# Altium project Car2014_finalRev.PrjPcb
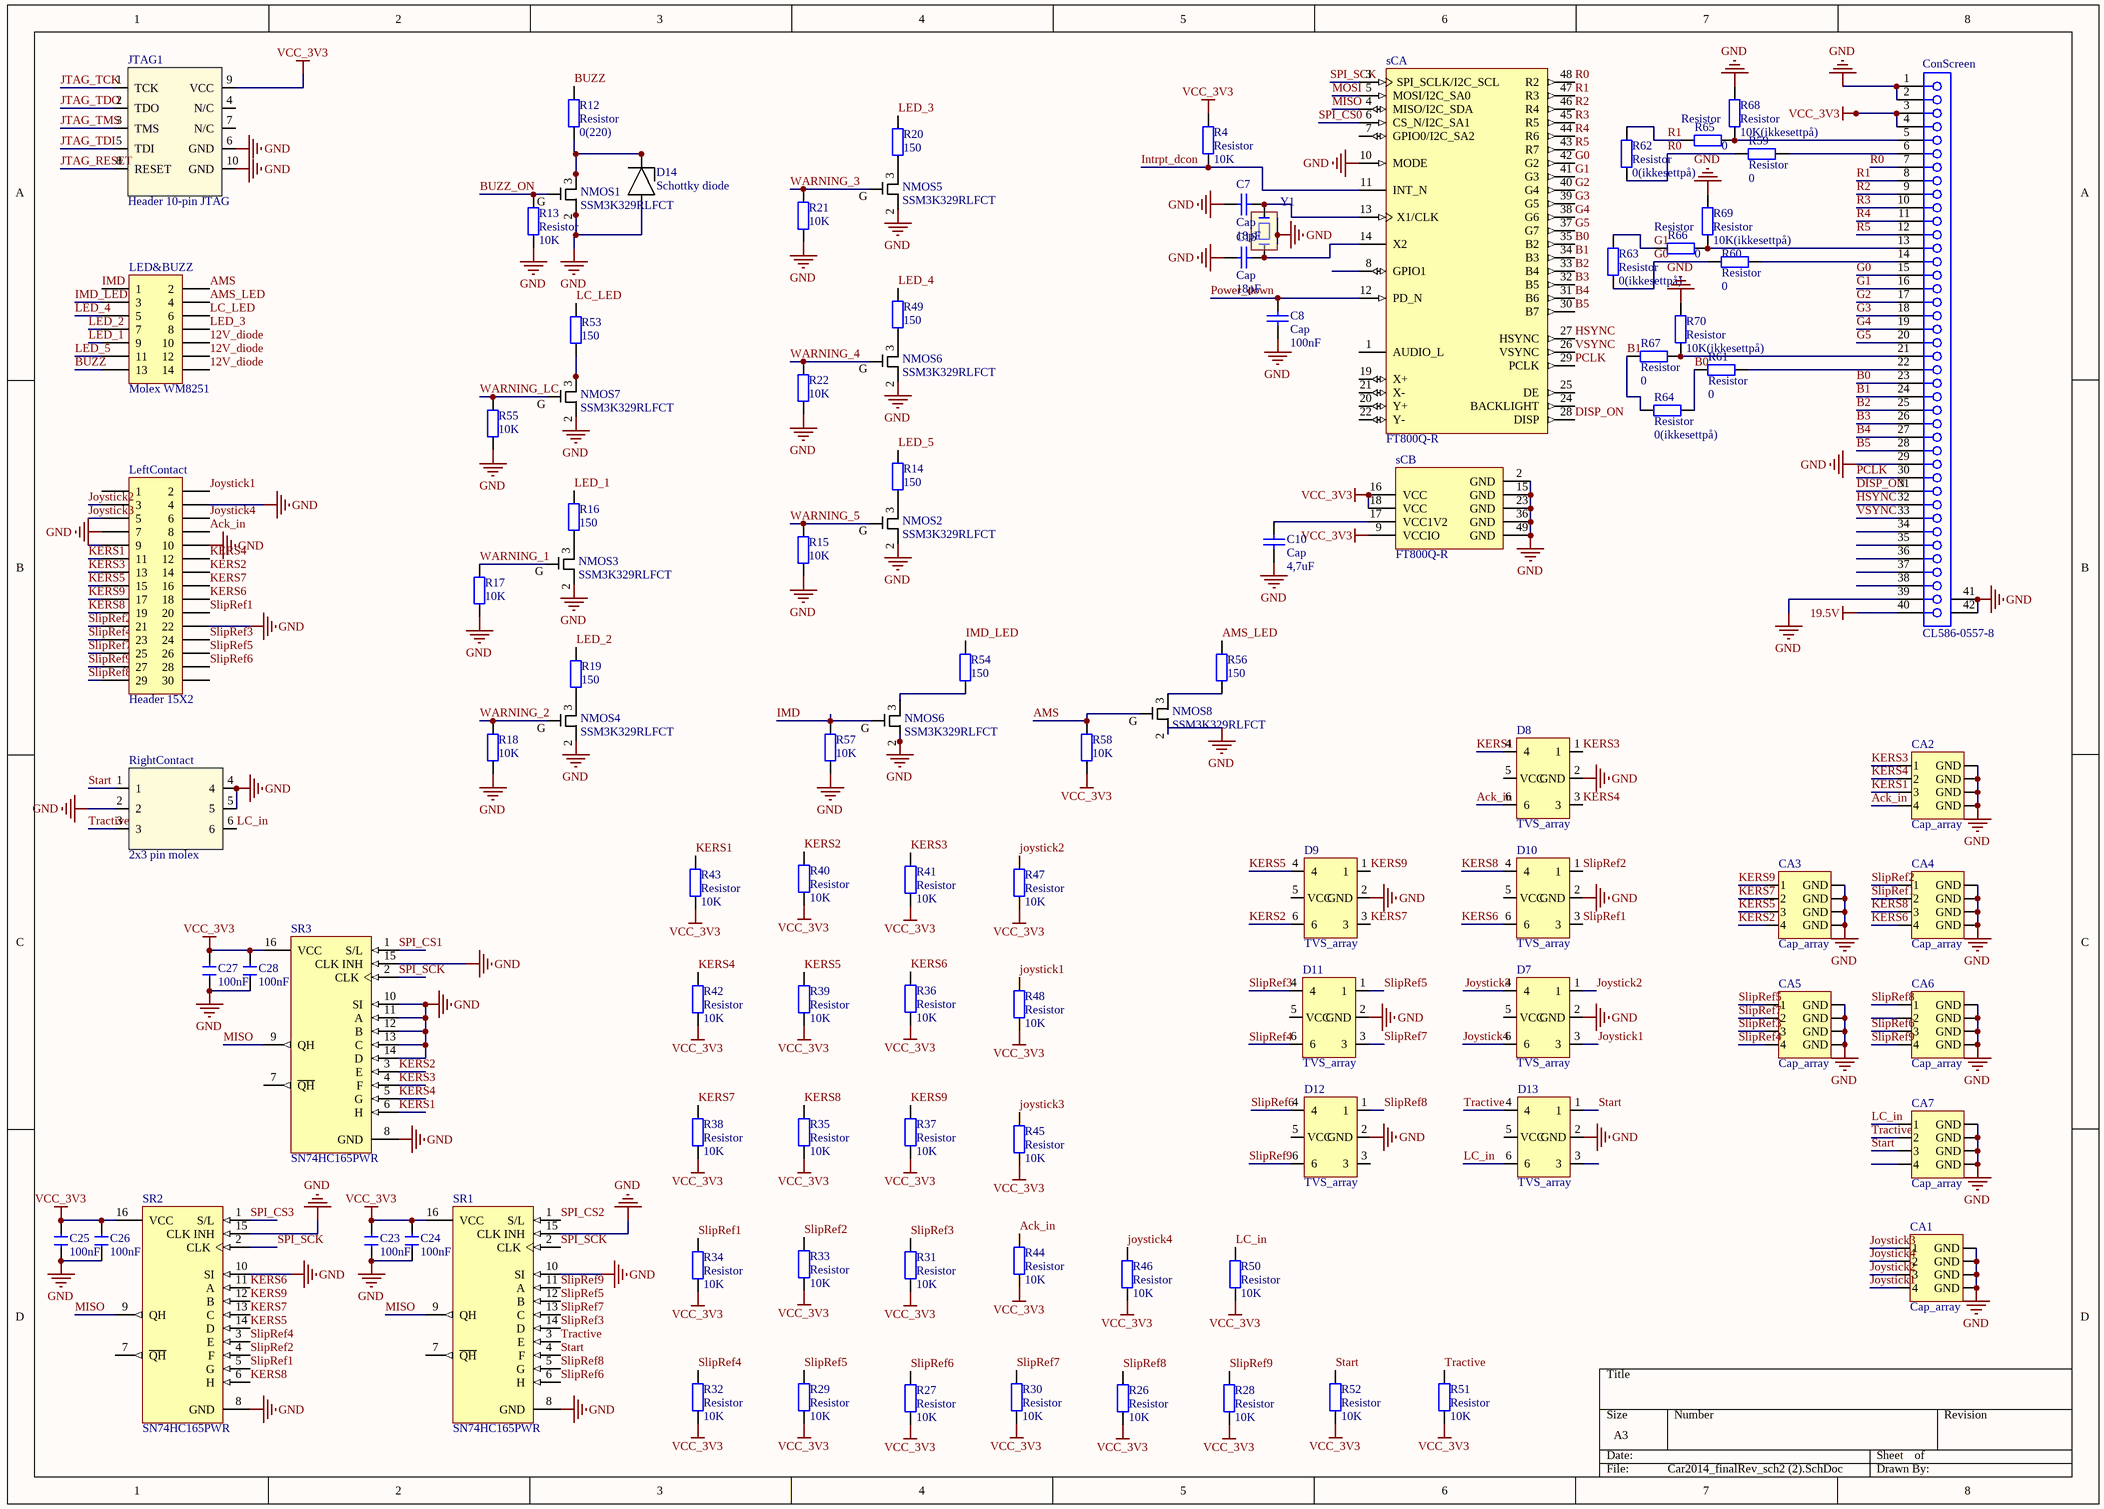
[diagram p0: Car2014_finalRev_sch2 (2).SchDoc]
2 sheets, 155 parts. Net scope: global (net labels, ports and power ports of the same name join across sheets).
Board file: Car2014_finalRev.PcbDoc
Sheets:
  Car2014_finalRev_sch2 (2).SchDoc
  Car2014_finalRev_sch1.SchDoc

## Sheet Car2014_finalRev_sch2 (2).SchDoc
size A3

### Parts
(Parts that share a designator on the sheet are numbered #1, #2 ... from top to bottom, then left to right.)
C7  Cap  value 18pF  [1608[0603]]
C8  Cap  value 100nF  [1608[0603]]
C10  Cap  value 4,7uF  [c0805]
C16  Cap  value 18pF  [1608[0603]]
C23  value 100nF  [CAPC1608L]  (hidden comment: Cap)
C24  value 100nF  [CAPC1608L]  (hidden comment: Cap)
C25  value 100nF  [CAPC1608L]  (hidden comment: Cap)
C26  value 100nF  [CAPC1608L]  (hidden comment: Cap)
C27  value 100nF  [CAPC1608L]  (hidden comment: Cap)
C28  value 100nF  [CAPC1608L]  (hidden comment: Cap)
CA1  Cap_array  [Cap_array_0805]
CA2  Cap_array  [Cap_array_0805]
CA3  Cap_array  [Cap_array_0805]
CA4  Cap_array  [Cap_array_0805]
CA5  Cap_array  [Cap_array_0805]
CA6  Cap_array  [Cap_array_0805]
CA7  Cap_array  [Cap_array_0805]
ConScreen  CL586-0557-8  [FH12A-40S-0.5SH]
D7  TVS_array  [TVS_array_SOT23]
D8  TVS_array  [TVS_array_SOT23]
D9  TVS_array  [TVS_array_SOT23]
D10  TVS_array  [TVS_array_SOT23]
D11  TVS_array  [TVS_array_SOT23]
D12  TVS_array  [TVS_array_SOT23]
D13  TVS_array  [TVS_array_SOT23]
D14  Schottky diode  [1608[0603]]
JTAG1  Header 10-pin JTAG  [10pin Header]
LED&BUZZ  Molex WM8251  [HDR2X7]
LeftContact  Header 15X2  [HDR2X15]
NMOS1  SSM3K329RLFCT  [SOT23]
NMOS2  SSM3K329RLFCT  [SOT23]
NMOS3  SSM3K329RLFCT  [SOT23]
NMOS4  SSM3K329RLFCT  [SOT23]
NMOS5  SSM3K329RLFCT  [SOT23]
NMOS6#1  SSM3K329RLFCT  [SOT23]
NMOS6#2  SSM3K329RLFCT  [SOT23]
NMOS7  SSM3K329RLFCT  [SOT23]
NMOS8  SSM3K329RLFCT  [SOT23]
R4  Resistor  value 10K  [1608[0603]]
R12  Resistor  value 0(220)  [1608[0603]]
R13  Resistor  value 10K  [1608[0603]]
R14  value 150  [RESC1608L]  (hidden comment: Resistor)
R15  value 10K  [RESC1608L]  (hidden comment: Resistor)
R16  value 150  [RESC1608L]  (hidden comment: Resistor)
R17  value 10K  [RESC1608L]  (hidden comment: Resistor)
R18  value 10K  [RESC1608L]  (hidden comment: Resistor)
R19  value 150  [RESC1608L]  (hidden comment: Resistor)
R20  value 150  [RESC1608L]  (hidden comment: Resistor)
R21  value 10K  [RESC1608L]  (hidden comment: Resistor)
R22  value 10K  [RESC1608L]  (hidden comment: Resistor)
R26  Resistor  value 10K  [1608[0603]]
R27  Resistor  value 10K  [1608[0603]]
R28  Resistor  value 10K  [1608[0603]]
R29  Resistor  value 10K  [1608[0603]]
R30  Resistor  value 10K  [1608[0603]]
R31  Resistor  value 10K  [1608[0603]]
R32  Resistor  value 10K  [1608[0603]]
R33  Resistor  value 10K  [1608[0603]]
R34  Resistor  value 10K  [1608[0603]]
R35  Resistor  value 10K  [1608[0603]]
R36  Resistor  value 10K  [1608[0603]]
R37  Resistor  value 10K  [1608[0603]]
R38  Resistor  value 10K  [1608[0603]]
R39  Resistor  value 10K  [1608[0603]]
R40  Resistor  value 10K  [1608[0603]]
R41  Resistor  value 10K  [1608[0603]]
R42  Resistor  value 10K  [1608[0603]]
R43  Resistor  value 10K  [1608[0603]]
R44  Resistor  value 10K  [1608[0603]]
R45  Resistor  value 10K  [1608[0603]]
R46  Resistor  value 10K  [1608[0603]]
R47  Resistor  value 10K  [1608[0603]]
R48  Resistor  value 10K  [1608[0603]]
R49  value 150  [RESC1608L]  (hidden comment: Resistor)
R50  Resistor  value 10K  [1608[0603]]
R51  Resistor  value 10K  [1608[0603]]
R52  Resistor  value 10K  [1608[0603]]
R53  value 150  [RESC1608L]  (hidden comment: Resistor)
R54  value 150  [RESC1608L]  (hidden comment: Resistor)
R55  value 10K  [RESC1608L]  (hidden comment: Resistor)
R56  value 150  [RESC1608L]  (hidden comment: Resistor)
R57  value 10K  [RESC1608L]  (hidden comment: Resistor)
R58  value 10K  [RESC1608L]  (hidden comment: Resistor)
R59  Resistor  value 0  [1608[0603]]
R60  Resistor  value 0  [1608[0603]]
R61  Resistor  value 0  [1608[0603]]
R62  Resistor  value 0(ikkesettpå)  [1608[0603]]
R63  Resistor  value 0(ikkesettpå)  [1608[0603]]
R64  Resistor  value 0(ikkesettpå)  [1608[0603]]
R65  Resistor  value 0  [1608[0603]]
R66  Resistor  value 0  [1608[0603]]
R67  Resistor  value 0  [1608[0603]]
R68  Resistor  value 10K(ikkesettpå)  [1608[0603]]
R69  Resistor  value 10K(ikkesettpå)  [1608[0603]]
R70  Resistor  value 10K(ikkesettpå)  [1608[0603]]
RightContact  2x3 pin molex  [2x3 pin molex]
sC  FT800Q-R  [VQFN-48_N]  (parts A,B of 2)
SR1  SN74HC165PWR  [TSOP65P640X120-16N]
SR2  SN74HC165PWR  [TSOP65P640X120-16N]
SR3  SN74HC165PWR  [TSOP65P640X120-16N]
Y1  Crystal  [SMD-CRYSTAL]  (value not drawn)

### Nets
19.5V: ConScreen.40
GND: C7.1 C8.1 C10.1 C16.1 C23.1 C24.1 C25.1 C26.1 C27.1 C28.1 CA1.5(GND) CA1.6(GND) CA1.7(GND) CA1.8(GND) CA2.5(GND) CA2.6(GND) CA2.7(GND) CA2.8(GND) CA3.5(GND) CA3.6(GND) CA3.7(GND) CA3.8(GND) CA4.5(GND) CA4.6(GND) CA4.7(GND) CA4.8(GND) CA5.5(GND) CA5.6(GND) CA5.7(GND) CA5.8(GND) CA6.5(GND) CA6.6(GND) CA6.7(GND) CA6.8(GND) CA7.5(GND) CA7.6(GND) CA7.7(GND) CA7.8(GND) ConScreen.1 ConScreen.2 ConScreen.29 ConScreen.39 ConScreen.41(MH1) ConScreen.42(MH2) D7.2(GND) D8.2(GND) D9.2(GND) D10.2(GND) D11.2(GND) D12.2(GND) D13.2(GND) D14.2 JTAG1.6(GND) JTAG1.10(GND) LeftContact.4 LeftContact.7 LeftContact.10 LeftContact.22 NMOS1.2(S) NMOS2.2(S) NMOS3.2(S) NMOS4.2(S) NMOS5.2(S) NMOS6#1.2(S) NMOS6#2.2(S) NMOS7.2(S) NMOS8.2(S) R13.2 R15.2 R17.2 R18.2 R21.2 R22.2 R55.1 R57.2 R68.1 R69.2 R70.2 RightContact.2 RightContact.4 RightContact.5 sC.2(GND) sC.10(MODE) sC.15(GND) sC.23(GND) sC.36(GND) sC.49(GND) SR1.8(GND) SR1.10(SI) SR1.15(CLK_INH) SR2.8(GND) SR2.10(SI) SR2.15(CLK_INH) SR3.8(GND) SR3.10(SI) SR3.11(A) SR3.12(B) SR3.13(C) SR3.14(D) SR3.15(CLK_INH) Y1.2 Y1.4
VCC_3V3: C23.2 C24.2 C25.2 C26.2 C27.2 C28.2 ConScreen.3 ConScreen.4 JTAG1.9(VCC) R4.2 R26.2 R27.2 R28.2 R29.2 R30.2 R31.2 R32.2 R33.2 R34.2 R35.2 R36.2 R37.2 R38.2 R39.2 R40.2 R41.2 R42.2 R43.2 R44.1 R45.1 R46.1 R47.1 R48.1 R50.1 R51.2 R52.2 R58.1 sC.9(VCCIO) sC.16(VCC) sC.18(VCC) SR1.16(VCC) SR2.16(VCC) SR3.16(VCC)
12V_diode: LED&BUZZ.10 LED&BUZZ.12 LED&BUZZ.14
Ack_in: CA2.4 D8.6 LeftContact.8 R44.2
AMS: LED&BUZZ.2 NMOS8.1(G) R58.2
AMS_LED: LED&BUZZ.4 R56.1
B0: ConScreen.23 R61.1 R64.2 sC.35(B2)
B1: ConScreen.24 R64.1 R67.1 sC.34(B3)
B2: ConScreen.25 sC.33(B4)
B3: ConScreen.26 sC.32(B5)
B4: ConScreen.27 sC.31(B6)
B5: ConScreen.28 sC.30(B7)
BUZZ: LED&BUZZ.13 R12.1
BUZZ_ON: NMOS1.1(G) R13.1
DISP_ON: ConScreen.31 sC.28(DISP)
G0: ConScreen.15 R60.2 R63.2 sC.42(G2)
G1: ConScreen.16 R63.1 R66.2 sC.41(G3)
G2: ConScreen.17 sC.40(G4)
G3: ConScreen.18 sC.39(G5)
G4: ConScreen.19 sC.38(G6)
G5: ConScreen.20 sC.37(G7)
HSYNC: ConScreen.32 sC.27(HSYNC)
IMD: LED&BUZZ.1 NMOS6#2.1(G) R57.1
IMD_LED: LED&BUZZ.3 R54.2
Intrpt_dcon: R4.1 sC.11(INT_N)
Joystick1: CA1.4 D7.3 LeftContact.2 R48.2
Joystick2: CA1.3 D7.1 LeftContact.3 R47.2
Joystick3: CA1.1 D7.4 LeftContact.5 R45.2
Joystick4: CA1.2 D7.6 LeftContact.6 R46.2
JTAG_RESET: JTAG1.8(RESET)
JTAG_TCK: JTAG1.1(TCK)
JTAG_TDI: JTAG1.5(TDI)
JTAG_TDO: JTAG1.2(TDO)
JTAG_TMS: JTAG1.3(TMS)
KERS1: CA2.3 D8.4 LeftContact.11 R43.1 SR3.6(H)
KERS2: CA3.4 D9.6 LeftContact.14 R40.1 SR3.3(E)
KERS3: CA2.1 D8.1 LeftContact.13 R41.1 SR3.4(F)
KERS4: CA2.2 D8.3 LeftContact.12 R42.1 SR3.5(G)
KERS5: CA3.3 D9.4 LeftContact.15 R39.1 SR2.14(D)
KERS6: CA4.4 D10.6 LeftContact.18 R36.1 SR2.11(A)
KERS7: CA3.2 D9.3 LeftContact.16 R38.1 SR2.13(C)
KERS8: CA4.3 D10.4 LeftContact.19 R35.1 SR2.6(H)
KERS9: CA3.1 D9.1 LeftContact.17 R37.1 SR2.12(B)
LC_in: CA7.1 D13.6 R50.2 RightContact.6
LC_LED: LED&BUZZ.6 R53.1
LED_1: LED&BUZZ.9 R16.2
LED_2: LED&BUZZ.7 R19.2
LED_3: LED&BUZZ.8 R20.2
LED_4: LED&BUZZ.5 R49.2
LED_5: LED&BUZZ.11 R14.2
MISO: sC.4(MISO/I2C_SDA) SR1.9(QH) SR2.9(QH) SR3.9(QH)
MOSI: sC.5(MOSI/I2C_SA0)
PCLK: ConScreen.30 sC.29(PCLK)
Power_down: C8.2 sC.12(PD_N)
R0: ConScreen.7 R59.2 R62.1 sC.48(R2)
R1: ConScreen.8 R62.2 R65.1 sC.47(R3)
R2: ConScreen.9 sC.46(R4)
R3: ConScreen.10 sC.45(R5)
R4: ConScreen.11 sC.44(R6)
R5: ConScreen.12 sC.43(R7)
SlipRef1: CA4.2 D10.3 LeftContact.20 R34.1 SR2.5(G)
SlipRef2: CA4.1 D10.1 LeftContact.21 R33.1 SR2.4(F)
SlipRef3: CA5.3 D11.4 LeftContact.24 R31.1 SR1.14(D)
SlipRef4: CA5.4 D11.6 LeftContact.23 R32.1 SR2.3(E)
SlipRef5: CA5.1 D11.1 LeftContact.26 R29.1 SR1.12(B)
SlipRef6: CA6.3 D12.4 LeftContact.28 R27.1 SR1.6(H)
SlipRef7: CA5.2 D11.3 LeftContact.25 R30.1 SR1.13(C)
SlipRef8: CA6.1 D12.1 LeftContact.29 R26.1 SR1.5(G)
SlipRef9: CA6.4 D12.6 LeftContact.27 R28.1 SR1.11(A)
SPI_CS0: sC.6(CS_N/I2C_SA1)
SPI_CS1: SR3.1(S/L)
SPI_CS2: SR1.1(S/L)
SPI_CS3: SR2.1(S/L)
SPI_SCK: sC.3(SPI_SCLK/I2C_SCL) SR1.2(CLK) SR2.2(CLK) SR3.2(CLK)
Start: CA7.3 D13.1 R52.1 RightContact.1 SR1.4(F)
Tractive: CA7.2 D13.4 R51.1 RightContact.3 SR1.3(E)
VSYNC: ConScreen.33 sC.26(VSYNC)
WARNING_1: NMOS3.1(G) R17.1
WARNING_2: NMOS4.1(G) R18.1
WARNING_3: NMOS5.1(G) R21.1
WARNING_4: NMOS6#1.1(G) R22.1
WARNING_5: NMOS2.1(G) R15.1
WARNING_LC: NMOS7.1(G) R55.2
NetC7_2: C7.2 sC.13(X1/CLK) Y1.3
NetC10_2: C10.2 sC.17(VCC1V2)
NetC16_2: C16.2 sC.14(X2) Y1.1
NetConScreen_5: ConScreen.5 R65.2 R68.2
NetConScreen_6: ConScreen.6 R59.1
NetConScreen_13: ConScreen.13 R66.1 R69.1
NetConScreen_14: ConScreen.14 R60.1
NetConScreen_21: ConScreen.21 R67.2 R70.1
NetConScreen_22: ConScreen.22 R61.2
NetD14_1: D14.1 NMOS1.3(D) R12.2
NetNMOS2_3: NMOS2.3(D) R14.1
NetNMOS3_3: NMOS3.3(D) R16.1
NetNMOS4_3: NMOS4.3(D) R19.1
NetNMOS5_3: NMOS5.3(D) R20.1
NetNMOS6#1_3: NMOS6#1.3(D) R49.1
NetNMOS6#2_3: NMOS6#2.3(D) R54.1
NetNMOS7_3: NMOS7.3(D) R53.2
NetNMOS8_3: NMOS8.3(D) R56.2

Not connected (* = marked no-connect by the designer): CA6 2; CA7 4; ConScreen 34 35 36 37 38; D7 5(VCC); D8 5(VCC); D9 5(VCC); D10 5(VCC); D11 5(VCC); D12 3 5(VCC); D13 3 5(VCC); JTAG1 4(N/C) 7(N/C); LeftContact 1 9 30; sC 1(AUDIO_L) 7(GPIO0/I2C_SA2) 8(GPIO1) 19(X+) 20(Y+) 21(X-) 22(Y-) 24(BACKLIGHT) 25(DE); SR1 7(~{QH}); SR2 7(~{QH}); SR3 7(~{QH})

### Library data of the parts
C7 C8 C10 C16 = Cap: Capacitor
C23-C28 = Cap: Capacitor; Voltage: ?V
ConScreen = CL586-0557-8: FH12 Series, "Flip-Lock" SMT/ZIF FFC/FPC Connector - 0.5mm Spaced Top Contact; Positions: 40; ContactMaterial: Phosphor Bronze; Current: 0.4A; PCB_Layout: Complies with manufacturer's recommendation.; Note: Pad dimensions follow nominal values, Suitable for Wave Soldering, Adjust for Re-flow.; Published: 17-Jul-2002; DatasheetVersion: 13-Nov-2000; PackageVersion: 13-Nov-2000; PackageReference: FH12A-40S-0.5SH; Publisher: Altium Limited; ComponentLink1Description: Manufacturer Link; ComponentLink1URL: http://www.hiroseusa.com/; ComponentLink2Description: Datasheet; ComponentLink2URL: http://www.hirose.co.jp/cataloge_hp/e58605370.pdf
LED&BUZZ = Header 7X2: Header, 7-Pin, Dual row; LatestRevisionDate: 17-Jul-2002; LatestRevisionNote: Re-released for DXP Platform.; Publisher: Altium Limited
LeftContact = Header 15X2: Header, 15-Pin, Dual row; LatestRevisionDate: 17-Jul-2002; LatestRevisionNote: Re-released for DXP Platform.; Publisher: Altium Limited
sC = FT800Q-R: FT800 Single Chip Embedded Graphic Controller (Embedded Video Engine), -40 to +85 degC, 48-pin VQFN, Pb-Free, Tape and Reel; Manufacturer: FTDI; DatasheetVersion: ver 1.1, Aug-2013; PackageVersion: Aug-13; PackageReference: VQFN-48; PackageDescription: 48-Pin Very Thin Quad Flat No-Lead, 7 x 7 x 0.9 mm Body, 0.5 mm Pitch; PartNumber: FT800Q-R; ComponentLink1Description: Manufacturer URL; ComponentLink1URL: http://www.ftdichip.com/; ComponentLink2Description: Datasheet; ComponentLink2URL: http://www.ftdichip.com/Support/Documents/DataSheets/ICs/DS_FT800.pdf

## Sheet Car2014_finalRev_sch1.SchDoc
size A3
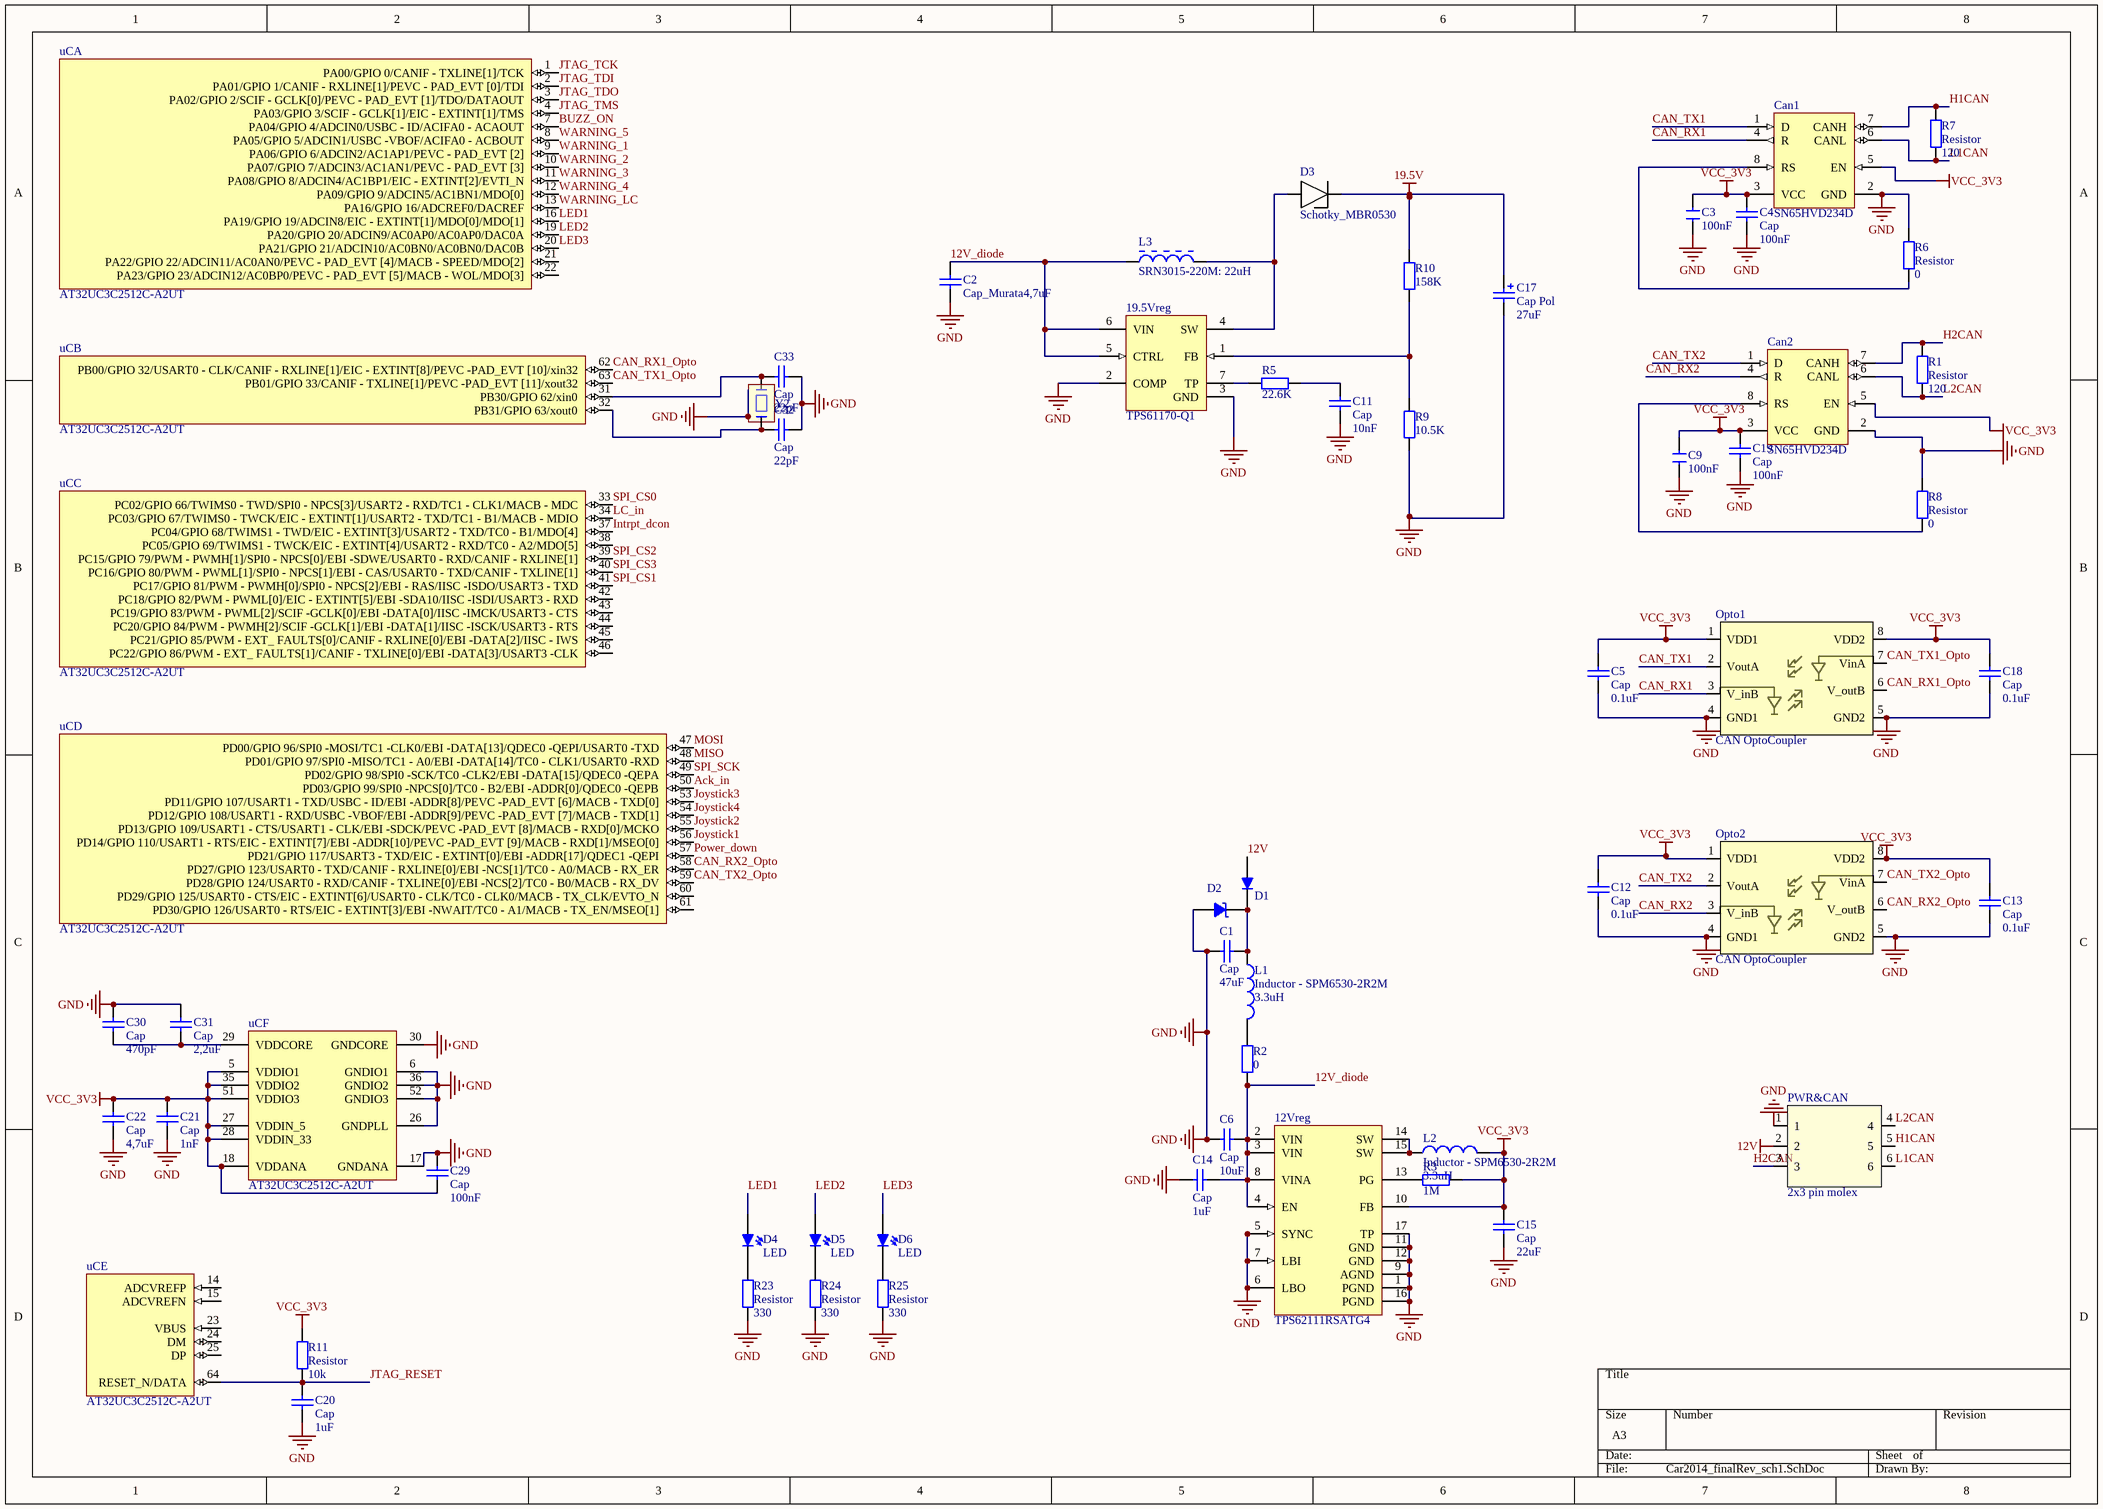
[diagram p1: Car2014_finalRev_sch1.SchDoc]

### Parts
12Vreg  TPS62111RSATG4  [RSA16-2700X2700TP]
19.5Vreg  TPS61170-Q1  [DRV6-1600X1000TP]
C1  Cap  value 47uF  [CAPC3216L]
C2  Cap_Murata4,7uF  [c0805]
C3  value 100nF  [CAPC1608L]  (hidden comment: Cap)
C4  Cap  value 100nF  [1608[0603]]
C5  Cap  value 0.1uF  [1608[0603]]
C6  Cap  value 10uF  [c0805]
C9  value 100nF  [CAPC1608L]  (hidden comment: Cap)
C11  Cap  value 10nF  [c0805]
C12  Cap  value 0.1uF  [1608[0603]]
C13  Cap  value 0.1uF  [1608[0603]]
C14  Cap  value 1uF  [c0805]
C15  Cap  value 22uF  [CAPC3216L]
C17  Cap Pol  value 27uF  [CAP_electrolyte]
C18  Cap  value 0.1uF  [1608[0603]]
C19  Cap  value 100nF  [1608[0603]]
C20  Cap  value 1uF  [1608[0603]]
C21  Cap  value 1nF  [1608[0603]]
C22  Cap  value 4,7uF  [c0805]
C29  Cap  value 100nF  [1608[0603]]
C30  Cap  value 470pF  [1608[0603]]
C31  Cap  value 2,2uF  [1608[0603]]
C32  Cap  value 22pF  [1608[0603]]
C33  Cap  value 22pF  [1608[0603]]
Can1  SN65HVD234D  [D8_M]
Can2  SN65HVD234D  [D8_M]
D1  STTH2R02  [STTH2R02A]  (value not drawn)
D2  TVS-diode_14V  [TVS-DIODE_14V]  (value not drawn)
D3  Schotky_MBR0530  [SOD-123]
D4  LED  [1608[0603]]
D5  LED  [1608[0603]]
D6  LED  [1608[0603]]
L1  Inductor - SPM6530-2R2M  value 3.3uH  [Drossel]
L2  Inductor - SPM6530-2R2M  value 3.3uH  [Drossel]
L3  SRN3015-220M: 22uH  [BOUR-SRN3015-2_V]
Opto1  CAN OptoCoupler  [SOIC 8pin,  optocoupler]
Opto2  CAN OptoCoupler  [SOIC 8pin,  optocoupler]
PWR&CAN  2x3 pin molex  [2x3 pin molex]
R1  Resistor  value 120  [1608[0603]]
R2  value 0  [RESC3216L]  (hidden comment: Resistor)
R3  value 1M  [RESC3216L]  (hidden comment: Resistor)
R5  value 22.6K  [RESC3216L]  (hidden comment: Resistor)
R6  Resistor  value 0  [1608[0603]]
R7  Resistor  value 120  [1608[0603]]
R8  Resistor  value 0  [1608[0603]]
R9  value 10.5K  [RESC3216L]  (hidden comment: Resistor)
R10  value 158K  [RESC3216L]  (hidden comment: Resistor)
R11  Resistor  value 10k  [1608[0603]]
R23  Resistor  value 330  [1608[0603]]
R24  Resistor  value 330  [1608[0603]]
R25  Resistor  value 330  [1608[0603]]
uC  AT32UC3C2512C-A2UT  [TQFP64_N]  (parts A,B,C,D,E,F of 6)
Y2  Crystal  [SMD-CRYSTAL]  (value not drawn)

### Nets
12V: D1.1(A) PWR&CAN.2
19.5V: C17.1 D3.2 R10.2
GND: 12Vreg.1(PGND) 12Vreg.5(SYNC) 12Vreg.6(LBO) 12Vreg.7(LBI) 12Vreg.9(AGND) 12Vreg.11(GND) 12Vreg.12(GND) 12Vreg.16(PGND) 12Vreg.17(TP) 19.5Vreg.2(COMP) 19.5Vreg.3(GND) C1.2 C2.1 C3.2 C4.2 C5.1 C6.1 C9.2 C11.1 C12.1 C13.1 C14.1 C15.1 C17.2 C18.1 C19.1 C20.1 C21.1 C22.1 C29.2 C30.2 C31.2 C32.1 C33.1 Can1.2(GND) Can2.2(GND) D2.A Opto1.4(GND1) Opto1.5(GND2) Opto2.4(GND1) Opto2.5(GND2) PWR&CAN.1 R6.2 R8.2 R9.1 R23.1 R24.1 R25.1 uC.6(GNDIO1) uC.17(GNDANA) uC.26(GNDPLL) uC.30(GNDCORE) uC.36(GNDIO2) uC.52(GNDIO3) Y2.2 Y2.4
VCC_3V3: 12Vreg.10(FB) C3.1 C4.1 C5.2 C9.1 C12.2 C13.2 C15.2 C18.2 C19.2 C21.2 C22.2 C29.1 Can1.3(VCC) Can1.5(EN) Can2.3(VCC) Can2.5(EN) L2.2 Opto1.1(VDD1) Opto1.8(VDD2) Opto2.1(VDD1) Opto2.8(VDD2) R3.2 R11.1 uC.5(VDDIO1) uC.18(VDDANA) uC.27(VDDIN_5) uC.28(VDDIN_33) uC.35(VDDIO2) uC.51(VDDIO3)
12V_diode: 12Vreg.2(VIN) 12Vreg.3(VIN) 12Vreg.4(EN) 12Vreg.8(VINA) 19.5Vreg.5(CTRL) 19.5Vreg.6(VIN) C2.2 C6.2 C14.2 L3.1 R2.1
Ack_in: uC.50(PD03/GPIO_99/SPI0_-NPCS[0]/TC0_-_B2/EBI_-ADDR[0]/QDEC0_-QEPB)
BUZZ_ON: uC.7(PA04/GPIO_4/ADCIN0/USBC_-_ID/ACIFA0_-_ACAOUT)
CAN_RX1: Can1.4(R) Opto1.3(V_inB)
CAN_RX1_Opto: Opto1.6(V_outB) uC.62(PB00/GPIO_32/USART0_-_CLK/CANIF_-_RXLINE[1]/EIC_-_EXTINT[8]/PEVC_-PAD_EVT_[10]/xin32)
CAN_RX2: Can2.4(R) Opto2.3(V_inB)
CAN_RX2_Opto: Opto2.6(V_outB) uC.58(PD27/GPIO_123/USART0_-_TXD/CANIF_-_RXLINE[0]/EBI_-NCS[1]/TC0_-_A0/MACB_-_RX_ER)
CAN_TX1: Can1.1(D) Opto1.2(VoutA)
CAN_TX1_Opto: Opto1.7(VinA) uC.63(PB01/GPIO_33/CANIF_-_TXLINE[1]/PEVC_-PAD_EVT_[11]/xout32)
CAN_TX2: Can2.1(D) Opto2.2(VoutA)
CAN_TX2_Opto: Opto2.7(VinA) uC.59(PD28/GPIO_124/USART0_-_RXD/CANIF_-_TXLINE[0]/EBI_-NCS[2]/TC0_-_B0/MACB_-_RX_DV)
H1CAN: Can1.7(CANH) PWR&CAN.5 R7.2
H2CAN: Can2.7(CANH) PWR&CAN.3 R1.2
Intrpt_dcon: uC.37(PC04/GPIO_68/TWIMS1_-_TWD/EIC_-_EXTINT[3]/USART2_-_TXD/TC0_-_B1/MDO[4])
Joystick1: uC.56(PD14/GPIO_110/USART1_-_RTS/EIC_-_EXTINT[7]/EBI_-ADDR[10]/PEVC_-PAD_EVT_[9]/MACB_-_RXD[1]/MSEO[0])
Joystick2: uC.55(PD13/GPIO_109/USART1_-_CTS/USART1_-_CLK/EBI_-SDCK/PEVC_-PAD_EVT_[8]/MACB_-_RXD[0]/MCKO)
Joystick3: uC.53(PD11/GPIO_107/USART1_-_TXD/USBC_-_ID/EBI_-ADDR[8]/PEVC_-PAD_EVT_[6]/MACB_-_TXD[0])
Joystick4: uC.54(PD12/GPIO_108/USART1_-_RXD/USBC_-VBOF/EBI_-ADDR[9]/PEVC_-PAD_EVT_[7]/MACB_-_TXD[1])
JTAG_RESET: C20.2 R11.2 uC.64(RESET_N/DATA)
JTAG_TCK: uC.1(PA00/GPIO_0/CANIF_-_TXLINE[1]/TCK)
JTAG_TDI: uC.2(PA01/GPIO_1/CANIF_-_RXLINE[1]/PEVC_-_PAD_EVT_[0]/TDI)
JTAG_TDO: uC.3(PA02/GPIO_2/SCIF_-_GCLK[0]/PEVC_-_PAD_EVT_[1]/TDO/DATAOUT)
JTAG_TMS: uC.4(PA03/GPIO_3/SCIF_-_GCLK[1]/EIC_-_EXTINT[1]/TMS)
L1CAN: Can1.6(CANL) PWR&CAN.6 R7.1
L2CAN: Can2.6(CANL) PWR&CAN.4 R1.1
LC_in: uC.34(PC03/GPIO_67/TWIMS0_-_TWCK/EIC_-_EXTINT[1]/USART2_-_TXD/TC1_-_B1/MACB_-_MDIO)
LED1: D4.1(A) uC.16(PA19/GPIO_19/ADCIN8/EIC_-_EXTINT[1]/MDO[0]/MDO[1])
LED2: D5.1(A) uC.19(PA20/GPIO_20/ADCIN9/AC0AP0/AC0AP0/DAC0A)
LED3: D6.1(A) uC.20(PA21/GPIO_21/ADCIN10/AC0BN0/AC0BN0/DAC0B)
MISO: uC.48(PD01/GPIO_97/SPI0_-MISO/TC1_-_A0/EBI_-DATA[14]/TC0_-_CLK1/USART0_-RXD)
MOSI: uC.47(PD00/GPIO_96/SPI0_-MOSI/TC1_-CLK0/EBI_-DATA[13]/QDEC0_-QEPI/USART0_-TXD)
Power_down: uC.57(PD21/GPIO_117/USART3_-_TXD/EIC_-_EXTINT[0]/EBI_-ADDR[17]/QDEC1_-QEPI)
SPI_CS0: uC.33(PC02/GPIO_66/TWIMS0_-_TWD/SPI0_-_NPCS[3]/USART2_-_RXD/TC1_-_CLK1/MACB_-_MDC)
SPI_CS1: uC.41(PC17/GPIO_81/PWM_-_PWMH[0]/SPI0_-_NPCS[2]/EBI_-_RAS/IISC_-ISDO/USART3_-_TXD)
SPI_CS2: uC.39(PC15/GPIO_79/PWM_-_PWMH[1]/SPI0_-_NPCS[0]/EBI_-SDWE/USART0_-_RXD/CANIF_-_RXLINE[1])
SPI_CS3: uC.40(PC16/GPIO_80/PWM_-_PWML[1]/SPI0_-_NPCS[1]/EBI_-_CAS/USART0_-_TXD/CANIF_-_TXLINE[1])
SPI_SCK: uC.49(PD02/GPIO_98/SPI0_-SCK/TC0_-CLK2/EBI_-DATA[15]/QDEC0_-QEPA)
WARNING_1: uC.9(PA06/GPIO_6/ADCIN2/AC1AP1/PEVC_-_PAD_EVT_[2])
WARNING_2: uC.10(PA07/GPIO_7/ADCIN3/AC1AN1/PEVC_-_PAD_EVT_[3])
WARNING_3: uC.11(PA08/GPIO_8/ADCIN4/AC1BP1/EIC_-_EXTINT[2]/EVTI_N)
WARNING_4: uC.12(PA09/GPIO_9/ADCIN5/AC1BN1/MDO[0])
WARNING_5: uC.8(PA05/GPIO_5/ADCIN1/USBC_-VBOF/ACIFA0_-_ACBOUT)
WARNING_LC: uC.13(PA16/GPIO_16/ADCREF0/DACREF)
Net12Vreg_13: 12Vreg.13(PG) R3.1
Net12Vreg_14: 12Vreg.14(SW) 12Vreg.15(SW) L2.1
Net19.5Vreg_1: 19.5Vreg.1(FB) R9.2 R10.1
Net19.5Vreg_4: 19.5Vreg.4(SW) D3.1 L3.2
Net19.5Vreg_7: 19.5Vreg.7(TP) R5.1
NetC1_1: C1.1 D1.2(K) D2.K L1.1
NetC11_2: C11.2 R5.2
NetC30_1: C30.1 C31.1 uC.29(VDDCORE)
NetC32_2: C32.2 uC.32(PB31/GPIO_63/xout0) Y2.3
NetC33_2: C33.2 uC.31(PB30/GPIO_62/xin0) Y2.1
NetCan1_8: Can1.8(RS) R6.1
NetCan2_8: Can2.8(RS) R8.1
NetD4_2: D4.2(K) R23.2
NetD5_2: D5.2(K) R24.2
NetD6_2: D6.2(K) R25.2
NetL1_2: L1.2 R2.2

Not connected (* = marked no-connect by the designer): uC 14(ADCVREFP) 15(ADCVREFN) 21(PA22/GPIO_22/ADCIN11/AC0AN0/PEVC_-_PAD_EVT_[4]/MACB_-_SPEED/MDO[2]) 22(PA23/GPIO_23/ADCIN12/AC0BP0/PEVC_-_PAD_EVT_[5]/MACB_-_WOL/MDO[3]) 23(VBUS) 24(DM) 25(DP) 38(PC05/GPIO_69/TWIMS1_-_TWCK/EIC_-_EXTINT[4]/USART2_-_RXD/TC0_-_A2/MDO[5]) 42(PC18/GPIO_82/PWM_-_PWML[0]/EIC_-_EXTINT[5]/EBI_-SDA10/IISC_-ISDI/USART3_-_RXD) 43(PC19/GPIO_83/PWM_-_PWML[2]/SCIF_-GCLK[0]/EBI_-DATA[0]/IISC_-IMCK/USART3_-_CTS) 44(PC20/GPIO_84/PWM_-_PWMH[2]/SCIF_-GCLK[1]/EBI_-DATA[1]/IISC_-ISCK/USART3_-_RTS) 45(PC21/GPIO_85/PWM_-_EXT__FAULTS[0]/CANIF_-_RXLINE[0]/EBI_-DATA[2]/IISC_-_IWS) 46(PC22/GPIO_86/PWM_-_EXT__FAULTS[1]/CANIF_-_TXLINE[0]/EBI_-DATA[3]/USART3_-CLK) 60(PD29/GPIO_125/USART0_-_CTS/EIC_-_EXTINT[6]/USART0_-_CLK/TC0_-_CLK0/MACB_-_TX_CLK/EVTO_N) 61(PD30/GPIO_126/USART0_-_RTS/EIC_-_EXTINT[3]/EBI_-NWAIT/TC0_-_A1/MACB_-_TX_EN/MSEO[1])

### Library data of the parts
12Vreg = CMP-0323-00165-1: Buck Step Down Regulator with 3.1 to 17 V Input and 3.3 V Output, -40 to 85 degC, 16-Pin QFN (RSA), Green (RoHS & no Sb/Br); Manufacturer: Texas Instruments; Switch Current Limit(Typ)(A): 2.4; Duty Cycle(Max)(%): 100; Rating: Catalog; SubFamily: Step-Down Regulator; Vin(Max)(V): 17; Regulated Outputs(#): 1; Synchronous Rectification: TRUE; Preset Vout(V): 3.3; Iout(Max)(A): 1.5; Vin(Min)(V): 3.1; Iq(Typ)(mA): 0.02; DatasheetVersion: SLVS585A; ComponentLink2Description: URL Link1; Eco-Plan: Green (RoHS & no Sb/Br); Mounting Technology: Surface Mount; Vout(Max)(V): 3.3; ComponentLink2URL: Samples URL:http://www.ti.com/product/tps54611#samples; Topology: Buck; PackageReference: RSA16-2700X2700TP; PackageVersion: revD, Jun-2011; Vout(Min)(V): 3.3; PackageDescription: 16-Pin Plastic Quad Flatpack No-Lead 0.65 mm Pitch; PartNumber: TPS62111RSATG4; Code_JEDEC: MO-220; ComponentLink1Description: Datasheet; ComponentLink1URL: http://www.ti.com/general/docs/lit/getliterature.tsp?genericPartNumber=TPS62111&fileType=pdf
19.5Vreg = CMP-0347-00038-1: Boost Voltage Converter with 3 to 18 V Input and 3 to 38 V Output, -40 to 85 degC, 6-Pin SON (DRV), Green (RoHS & no Sb/Br); Manufacturer: Texas Instruments; PartNumber: TPS61170DRVTG4; Vin(Max)(V): 18; SubFamily: Step-Up Regulator; Vout(Max)(V): 38; Vout(Min)(V): 3; Regulated Outputs(#): 1; Switching Frequency(Max)(kHz): 1200; Dynamic Voltage Scaling: TRUE; ComponentLink1Description: Datasheet; ComponentLink2Description: Package Specification; Topology: Boost; ComponentLink2URL: http://www.ti.com/litv/pdf/mpds216d; PackageVersion: revE, Oct-2010; Mounting Technology: Surface Mount; Eco-Plan: Green (RoHS & no Sb/Br); ComponentLink1URL: http://www.ti.com/general/docs/lit/getliterature.tsp?genericPartNumber=TPS61170&fileType=pdf; Vin(Min)(V): 3; DatasheetVersion: SLVS789C; PackageDescription: 6-Pin Plastic Small Outline No-Lead, 2 x 2 x 0.8 mm Body, 0.65 mm Pitch, Exposed Pad; PackageReference: DRV6-1600X1000TP
C1 C4-C6 C11-C15 C18-C22 C29-C33 = Cap: Capacitor
C2 = Cap: Capacitor; Value: 4,7uF
C3 C9 = Cap: Capacitor; Voltage: ?V
C17 = Cap Pol: Polarized Capacitor (Radial); Published: 8-Jun-2000; LatestRevisionDate: 17-Jul-2002; LatestRevisionNote: Re-released for DXP Platform.; PackageReference: RB7.6-15; Publisher: Altium Limited; PackageDescription: Polarized Capacitor (Radial); 2 Leads
Can1 Can2 = CMP-0315-00083-1: 3.3V CAN Transceiver with Sleep Mode, 6 mA, -40 to 125 degC, 8-pin SOIC (D), Green (RoHS & no Sb/Br); Manufacturer: Texas Instruments; Receivers Per Package: 1; ICC(Max)(mA): 6; Bus Fault Voltage(V): +/-30; Supply Voltage(s)(V): 3.3; Rating: Catalog; Transient Pulse Protection(V): -100 to 100; PartNumber: SN65HVD234D; SubFamily: CAN; DatasheetVersion: SLLS557F; Mounting Technology: Surface Mount; Eco-Plan: Green (RoHS & no Sb/Br); PackageVersion: revM, Jun-2011; PackageReference: D8; ComponentLink1Description: Datasheet; Drivers Per Package: 1; Isolated: No; ComponentLink1URL: http://www.ti.com/general/docs/lit/getliterature.tsp?genericPartNumber=SN65HVD234&fileType=pdf; PackageDescription: 8-Pin Plastic Small Outline Integrated Circuit, 4.9 x 3.9 mm, Pitch 1.27 mm Pitch; Code_JEDEC: MS-012AA; Low Power Mode: Sleep; Footprint: PCA82C250, excludes pin5
L1 L2 = Inductor - SPM6530-2R2M: SMT Power Choke Coil; Size 7.3×6.6×3.0mm, ±20% Tolerance, 3.3uH, 6A; PCB_Layout: Complies with manufacturer's recommendation.; Published: 26-Sep-2008; DatasheetVersion: Oct-2007; PackageVersion: Oct-2007; PackageReference: PCMC063T; Publisher: Altium Limited; PackageDescription: SM Power Choke Coil; 2 Leads; Body 7.3 x 6.6 x 3.0 mm (LxWxH); ComponentLink1Description: Manufacturer Link; ComponentLink1URL: http://www.susumu.co.jp/; ComponentLink2Description: Datasheet; ComponentLink2URL: http://www.susumu.co.jp/english/pdf/products-j07-01.pdf
L3 = CMP-0007-00013-1: Semi-shielded Power Inductor, 22 uH, +/- 20%, 0.6 A, -40 to 125 degC, 3 x 3 x 1.5 mm SMD, RoHS and Halogen Free, Tape and Reel; Manufacturer: Bourns; SRF Min: 28 MHz; Isat: 0.58 A; Resistance to Solder Heat: +260 degC for 10 sec.; Inductance tolerance: +/- 20%; Rated current: 0.6 A; DCR Max: 0.622 Ohm; RoHS: TRUE; ComponentLink1Description: Manufacturer URL; ComponentLink3URL: http://www.bourns.com/data/global/pdfs/SRN3015.pdf; PartNumber: SRN3015-220M; DatasheetVersion: Aug-11; Mounting Technology: Surface Mount; ComponentLink3Description: Package Specification; ComponentLink2Description: Datasheet; Operating Temperature: -40 to 125 degC; Inductance: 22 uH; PackageDescription: 2-Pin SMD, Body 3 x 3 mm, Height 1.5 mm; Packing: Tape and Reel; PackageReference: SRN3015; ComponentLink2URL: http://www.bourns.com/data/global/pdfs/SRN3015.pdf; ComponentLink1URL: http://www.bourns.com/
Opto1 Opto2 = CAN OptoCoupler: Manufacturers no: FOD8012; Digikey no: FOD8012-ND; price: 20.88 NOK
uC = CMP-0092-00218-1: 32-bit AVR UC3 C Series Microcontroller, 512KB Flash, 68KB SRAM, 45 GPIO pins, Industrial Grade, 64- Pin TQFP, Tray; ComponentLink3URL: http://www.atmel.com/dyn/resources/prod_documents/32117s.pdf; Code_JEDEC: MS-026; ComponentLink1Description: Manufacturer URL; ComponentLink2URL: http://www.atmel.com/dyn/resources/prod_documents/doc32117.pdf; PackageVersion: 2011; PackageReference: TQFP64; DatasheetVersion: revC, Aug-2011; ComponentLink2Description: AT32UC3C Datasheet; PackageDescription: 64-Pin Thin Quad Flat Pack, 10 x 10 x 1.0 mm Body, 0.5 mm Pitch; ComponentLink3Description: AT32UC3C Summary; ComponentLink1URL: http://www.atmel.com/

## Nets that join several sheets
19.5V: Car2014_finalRev_sch2 (2) (ConScreen.40), Car2014_finalRev_sch1 (C17.1 D3.2 R10.2)
GND: Car2014_finalRev_sch2 (2) (102 pins), Car2014_finalRev_sch1 (56 pins)
VCC_3V3: Car2014_finalRev_sch2 (2) (43 pins), Car2014_finalRev_sch1 (30 pins)
12V_diode: Car2014_finalRev_sch2 (2) (LED&BUZZ.10 LED&BUZZ.12 LED&BUZZ.14), Car2014_finalRev_sch1 (11 pins)
Ack_in: Car2014_finalRev_sch2 (2) (CA2.4 D8.6 LeftContact.8 R44.2), Car2014_finalRev_sch1 (uC.50)
BUZZ_ON: Car2014_finalRev_sch2 (2) (NMOS1.1 R13.1), Car2014_finalRev_sch1 (uC.7)
Intrpt_dcon: Car2014_finalRev_sch2 (2) (R4.1 sC.11), Car2014_finalRev_sch1 (uC.37)
Joystick1: Car2014_finalRev_sch2 (2) (CA1.4 D7.3 LeftContact.2 R48.2), Car2014_finalRev_sch1 (uC.56)
Joystick2: Car2014_finalRev_sch2 (2) (CA1.3 D7.1 LeftContact.3 R47.2), Car2014_finalRev_sch1 (uC.55)
Joystick3: Car2014_finalRev_sch2 (2) (CA1.1 D7.4 LeftContact.5 R45.2), Car2014_finalRev_sch1 (uC.53)
Joystick4: Car2014_finalRev_sch2 (2) (CA1.2 D7.6 LeftContact.6 R46.2), Car2014_finalRev_sch1 (uC.54)
JTAG_RESET: Car2014_finalRev_sch2 (2) (JTAG1.8), Car2014_finalRev_sch1 (C20.2 R11.2 uC.64)
JTAG_TCK: Car2014_finalRev_sch2 (2) (JTAG1.1), Car2014_finalRev_sch1 (uC.1)
JTAG_TDI: Car2014_finalRev_sch2 (2) (JTAG1.5), Car2014_finalRev_sch1 (uC.2)
JTAG_TDO: Car2014_finalRev_sch2 (2) (JTAG1.2), Car2014_finalRev_sch1 (uC.3)
JTAG_TMS: Car2014_finalRev_sch2 (2) (JTAG1.3), Car2014_finalRev_sch1 (uC.4)
LC_in: Car2014_finalRev_sch2 (2) (CA7.1 D13.6 R50.2 RightContact.6), Car2014_finalRev_sch1 (uC.34)
MISO: Car2014_finalRev_sch2 (2) (sC.4 SR1.9 SR2.9 SR3.9), Car2014_finalRev_sch1 (uC.48)
MOSI: Car2014_finalRev_sch2 (2) (sC.5), Car2014_finalRev_sch1 (uC.47)
Power_down: Car2014_finalRev_sch2 (2) (C8.2 sC.12), Car2014_finalRev_sch1 (uC.57)
SPI_CS0: Car2014_finalRev_sch2 (2) (sC.6), Car2014_finalRev_sch1 (uC.33)
SPI_CS1: Car2014_finalRev_sch2 (2) (SR3.1), Car2014_finalRev_sch1 (uC.41)
SPI_CS2: Car2014_finalRev_sch2 (2) (SR1.1), Car2014_finalRev_sch1 (uC.39)
SPI_CS3: Car2014_finalRev_sch2 (2) (SR2.1), Car2014_finalRev_sch1 (uC.40)
SPI_SCK: Car2014_finalRev_sch2 (2) (sC.3 SR1.2 SR2.2 SR3.2), Car2014_finalRev_sch1 (uC.49)
WARNING_1: Car2014_finalRev_sch2 (2) (NMOS3.1 R17.1), Car2014_finalRev_sch1 (uC.9)
WARNING_2: Car2014_finalRev_sch2 (2) (NMOS4.1 R18.1), Car2014_finalRev_sch1 (uC.10)
WARNING_3: Car2014_finalRev_sch2 (2) (NMOS5.1 R21.1), Car2014_finalRev_sch1 (uC.11)
WARNING_4: Car2014_finalRev_sch2 (2) (NMOS6#1.1 R22.1), Car2014_finalRev_sch1 (uC.12)
WARNING_5: Car2014_finalRev_sch2 (2) (NMOS2.1 R15.1), Car2014_finalRev_sch1 (uC.8)
WARNING_LC: Car2014_finalRev_sch2 (2) (NMOS7.1 R55.2), Car2014_finalRev_sch1 (uC.13)